# Altium schematic sheet dtb-222-24V-supply.SchDoc
size 381 x 241 mm; SheetNumber: 3; SheetTotal: 3
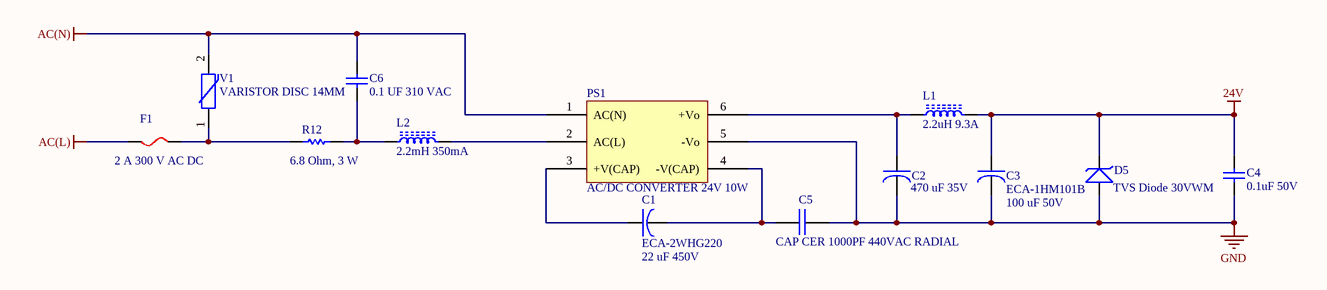
[diagram p0: dtb-222-24V-supply.SchDoc]

## Parts
?  (no value)  (graphical)
C1  ECA-2WHG220  value 22 uF 450V  [ECA-2WHG220]
C2  value 470 uF 35V  [35PX470MEFC10X12.5]  (hidden comment: 35PX470MEFC10X12.5)
C3  ECA-1HM101B  value 100 uF 50V  [ECA-1HM101B]
C4  value 0.1uF 50V  [Standard VoltServer 0603 Capacitor Footprint]  (hidden comment: CGA3E2X7R1H104K080AE)
C5  CAP CER 1000PF 440VAC RADIAL  [CD45-E2GA102M-VKA]
C6  value 0.1 UF 310 VAC  [890334023023CS]  (hidden comment: CAP FILM 0.1UF 10%)
D5  value TVS Diode 30VWM  [SMBJ30A]  (hidden comment: TVS DIODE 30VWM 48.4VC SMB)
F1  2 A 300 V AC DC  [SS-5H-2A-APH]
L1  value 2.2uH 9.3A  [0630CDMCCDS-2R2MC]  (hidden comment: FIXED IND 2.2UH 9.3A 15MOHM SMD)
L2  value 2.2mH 350mA  [RLB1112V4-222J]  (hidden comment: FIXED IND 2.2MH 350MA 3.2 OHM TH)
PS1  AC/DC CONVERTER 24V 10W  [LS10-13B24R3]
R12  value 6.8 Ohm, 3 W  [AC03000006808JAC00]  (hidden comment: RES 6.8 OHM 3W 5% AXIAL)
V1  VARISTOR DISC 14MM  [B72214S0351K101]

## Nets
24V: C3.1 C4.2 D5.1(Cathode) L1.2
AC(L): F1.1
AC(N): C6.2 PS1.1(AC(N)) V1.2
GND: C2.2 C3.2 C4.1 C5.2 D5.2(Anode) PS1.5(-Vo)
NetC1_1: C1.1 PS1.3(+V(CAP))
NetC1_2: C1.2 C5.1 PS1.4(-V(CAP))
NetC2_1: C2.1 L1.1 PS1.6(+Vo)
NetC6_1: C6.1 L2.1 R12.2
NetF1_2: F1.2 R12.1 V1.1
NetL2_2: L2.2 PS1.2(AC(L))

## Notes on the sheet
- Size
- Title
- B
- Project
- Rev
- Date:
- Sheet
- of

## Library data of the parts
? = VoltServer Title Block
C1 = ECA-2WHG220: 22 µF 450 V Aluminum Electrolytic Capacitors Radial, Can 2000 Hrs @ 105°C; Manufacturer: Panasonic Electronic Components; Vendor: Digikey; Vendor PN: P5877-ND; Manufacturer PN: ECA-2WHG220
C2 = 35PX470MEFC10X12.5: 470 µF 35 V Aluminum Electrolytic Capacitors Radial, Can 2000 Hrs @ 105°C; Manufacturer: Rubycon; Vendor: Digikey; Vendor PN: 1189-1280-ND; Manufacturer PN: 35PX470MEFC10X12.5
C3 = ECA-1HM101B: 100 µF 20% 50 V Aluminum Electrolytic Capacitors Radial, Can 2000 Hrs @ 85°C; Manufacturer: Panasonic Electronic Components; Vendor: Digikey; Vendor PN: P10397TB-ND; Manufacturer PN: ECA-1HM101B
C4 = CGA3E2X7R1H104K080AE: CAP CER 0.1UF 50V 10% X7R 0603; Manufacturer: TDK; Vendor: Digikey; Vendor PN: 445-15957-1-ND; Manufacturer PN: CGA3E2X7R1H104K080AE
C5 = CD45-E2GA102M-VKA: 1000 pF ±20% 440VAC Ceramic Capacitor E Radial, Disc; Manufacturer: TDK Corporation; Vendor: Digi-Key; Vendor PN: 445-175355-1-ND; Value: CAP CER 1000PF 440VAC RADIAL; Manufacturer PN: CD45-E2GA102M-VKA
C6 = 890334023023CS: 0.1 µF Film Capacitor 310V Polypropylene (PP), Metallized Radial; Manufacturer: Wurth Elektronik; Vendor: Digikey; Vendor PN: 732-5733-ND; Manufacturer PN: 890334023023CS
D5 = SMBJ30A: 48.4V Clamp 12.4A Ipp Tvs Diode Surface Mount SMB (DO-214AA); Manufacturer: Bourns Inc.; Vendor PN: SMBJ30ABTR-ND; Vendor: Digikey; Manufacturer PN: SMBJ30A
F1 = SS-5H-2A-APH: 2 A 300 V AC DC Fuse Board Mount (Cartridge Style Excluded) Through Hole Radial, Box; Manufacturer: Eaton; Vendor: Digi-Key; Vendor PN: 283-4166-1-ND; Value: FUSE BOARD MNT 2A 300VAC RADIAL; Manufacturer PN: SS-5H-2A-APH
L1 = 0630CDMCCDS-2R2MC: 2.2 µH Shielded Molded Inductor 9.3 A 15mOhm Max Nonstandard; Manufacturer: Sumida America Components Inc.; Vendor: Digikey; Vendor PN: 308-2464-6-ND; Manufacturer PN: 0630CDMCCDS-2R2MC
L2 = RLB1112V4-222J: 2.2 mH Unshielded Drum Core, Wirewound Inductor 350 mA 3.2Ohm Max Radial, Vertical Cylinder; Manufacturer: Bourns Inc.; Vendor: Digikey; Vendor PN: 118-RLB1112V4-222JTR-ND; Manufacturer PN: RLB1112V4-222J
PS1 = LS10-13B24R3: Open Frame AC DC Converters 1 Output 24V 420mA 85 ~ 305 VAC, 100 ~ 430 VDC Input; Manufacturer: Mornsun America, LLC; Vendor: Digi-Key; Vendor PN: 2725-LS10-13B24R3-ND; Value: AC/DC CONVERTER 24V 10W; Manufacturer PN: LS10-13B24R3
R12 = AC03000006808JAC00: 6.8 Ohms ±5% 3W Through Hole Resistor Axial Flame Retardant Coating, Pulse Withstanding, Safety Wirewound; Manufacturer: Vishay Beyschlag/Draloric/BB Components; Vendor: Digi-Key; Vendor PN: 749-AC03000006808JAC00CT-ND; Manufacturer PN: AC03000006808JAC00
V1 = B72214S0351K101: 560 V 4.5 kA Varistor 1 Circuit Through Hole Disc 14mm; Manufacturer: EPCOS - TDK Electronics; Vendor: Digi-Key; Vendor PN: 495-6464-ND; Value: 560 V 4.5 kA Varistor; Manufacturer PN: B72214S0351K101